# Altium schematic sheet receivers1.SchDoc
size A4
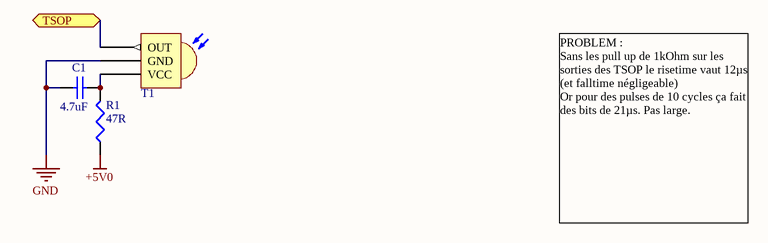
[diagram p0: receivers1.SchDoc]

## Parts
C1  value 4.7uF  [C0805C]  (hidden comment: CAP)
R1  value 47R  [C0805R]  (hidden comment: RES)
T1  TSOP7000  [TSOP IR]  (value not drawn)

## Ports
TSOP

## Nets
+5V0: R1.1
GND: C1.2 T1.2(GND)
TSOP: T1.1(OUT) ; port TSOP
NetC1_1: C1.1 R1.2 T1.3(VCC)

## Notes on the sheet
- PROBLEM :
  Sans les pull up de 1kOhm sur les sorties des TSOP le risetime vaut 12µs
  (et falltime négligeable)
  Or pour des pulses de 10 cycles ça fait des bits de 21µs. Pas large.

## Library data of the parts
C1 = CAP: Capacitor; Published: 8-Jun-2000; LatestRevisionDate: 29-May-2009; LatestRevisionNote: IPC-7351 Footprint Added.; PackageReference: C1206; Publisher: Altium Limited; PackageDescription: Chip Capacitor
R1 = RES: Resistor; Published: 8-Jun-2000; LatestRevisionDate: 29-May-2009; LatestRevisionNote: IPC-7351 Footprint Added.; PackageReference: J1-0603; Publisher: Altium Limited; PackageDescription: Chip Resistor
T1 = TSOP7000: Vishay 455kHz IR Receiver